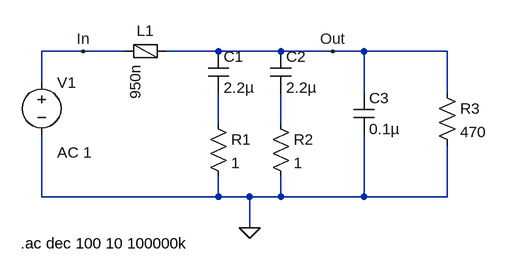
[diagram p0: schematic AVDD Filter SPICE.asc]
AVDD Filter SPICE.asc, the LTspice schematic file:
Version 4.1
SHEET 1 880 680
WIRE -80 -96 -144 -96
WIRE -16 -96 -80 -96
WIRE 128 -96 48 -96
WIRE 224 -96 128 -96
WIRE 304 -96 224 -96
WIRE 352 -96 304 -96
WIRE 480 -96 352 -96
WIRE -144 -48 -144 -96
WIRE 352 -32 352 -96
WIRE 480 -32 480 -96
WIRE 128 16 128 -32
WIRE 224 16 224 -32
WIRE -144 128 -144 32
WIRE 128 128 128 96
WIRE 128 128 -144 128
WIRE 176 128 128 128
WIRE 224 128 224 96
WIRE 224 128 176 128
WIRE 352 128 352 32
WIRE 352 128 224 128
WIRE 480 128 480 48
WIRE 480 128 352 128
WIRE 176 176 176 128
FLAG 176 176 0
FLAG -80 -96 In
FLAG 304 -96 Out
SYMBOL res 112 0 R0
SYMATTR InstName R1
SYMATTR Value 1
SYMATTR SpiceLine tol=1
SYMBOL res 208 0 R0
SYMATTR InstName R2
SYMATTR Value 1
SYMATTR SpiceLine tol=1
SYMBOL cap 112 -96 R0
SYMATTR InstName C1
SYMATTR Value 2.2µ
SYMATTR SpiceLine V=16 Irms=0 Rser=0 Lser=0 mfg="Murata" pn="GRM188Z71C225ME43" type="X7R"
SYMBOL cap 208 -96 R0
SYMATTR InstName C2
SYMATTR Value 2.2µ
SYMATTR SpiceLine V=16 Irms=0 Rser=0 Lser=0 mfg="Murata" pn="GRM188Z71C225ME43" type="X7R"
SYMBOL cap 336 -32 R0
SYMATTR InstName C3
SYMATTR Value 0.1µ
SYMATTR SpiceLine V=100 Irms=0 Rser=0 Lser=0 mfg="Murata" pn="GCM21BR72A104KA37" type="X7R"
SYMBOL FerriteBead 16 -96 R90
WINDOW 0 -16 0 VBottom 2
SYMATTR InstName L1
SYMATTR Value 950n
SYMATTR SpiceLine Ipk=3 Rser=0.029 Rpar=290 Cpar=1.45p mfg="Würth Elektronik" pn="742792121 WE-CBF 1206"
SYMBOL voltage -144 -64 R0
WINDOW 123 24 124 Left 2
WINDOW 39 0 0 Left 0
SYMATTR InstName V1
SYMATTR Value ""
SYMATTR Value2 AC 1
SYMBOL res 464 -48 R0
SYMATTR InstName R3
SYMATTR Value 470
TEXT -176 200 Left 2 !.ac dec 100 10 100000k

The netlist it stands for:
* AVDD Filter SPICE.asc
R1 N001 0 1 tol=1
R2 N002 0 1 tol=1
C1 Out N001 2.2µ V=16 Irms=0 Rser=0 Lser=0 mfg="Murata" pn="GRM188Z71C225ME43" type="X7R"
C2 Out N002 2.2µ V=16 Irms=0 Rser=0 Lser=0 mfg="Murata" pn="GRM188Z71C225ME43" type="X7R"
C3 Out 0 0.1µ V=100 Irms=0 Rser=0 Lser=0 mfg="Murata" pn="GCM21BR72A104KA37" type="X7R"
L1 Out In 950n Ipk=3 Rser=0.029 Rpar=290 Cpar=1.45p mfg="Würth Elektronik" pn="742792121 WE-CBF 1206"
V1 In 0 AC 1
R3 Out 0 470
.ac dec 100 10 100000k
.backanno
.end